# EAGLE design spi_neopixel_rev2 (EAGLE 8.5.0)
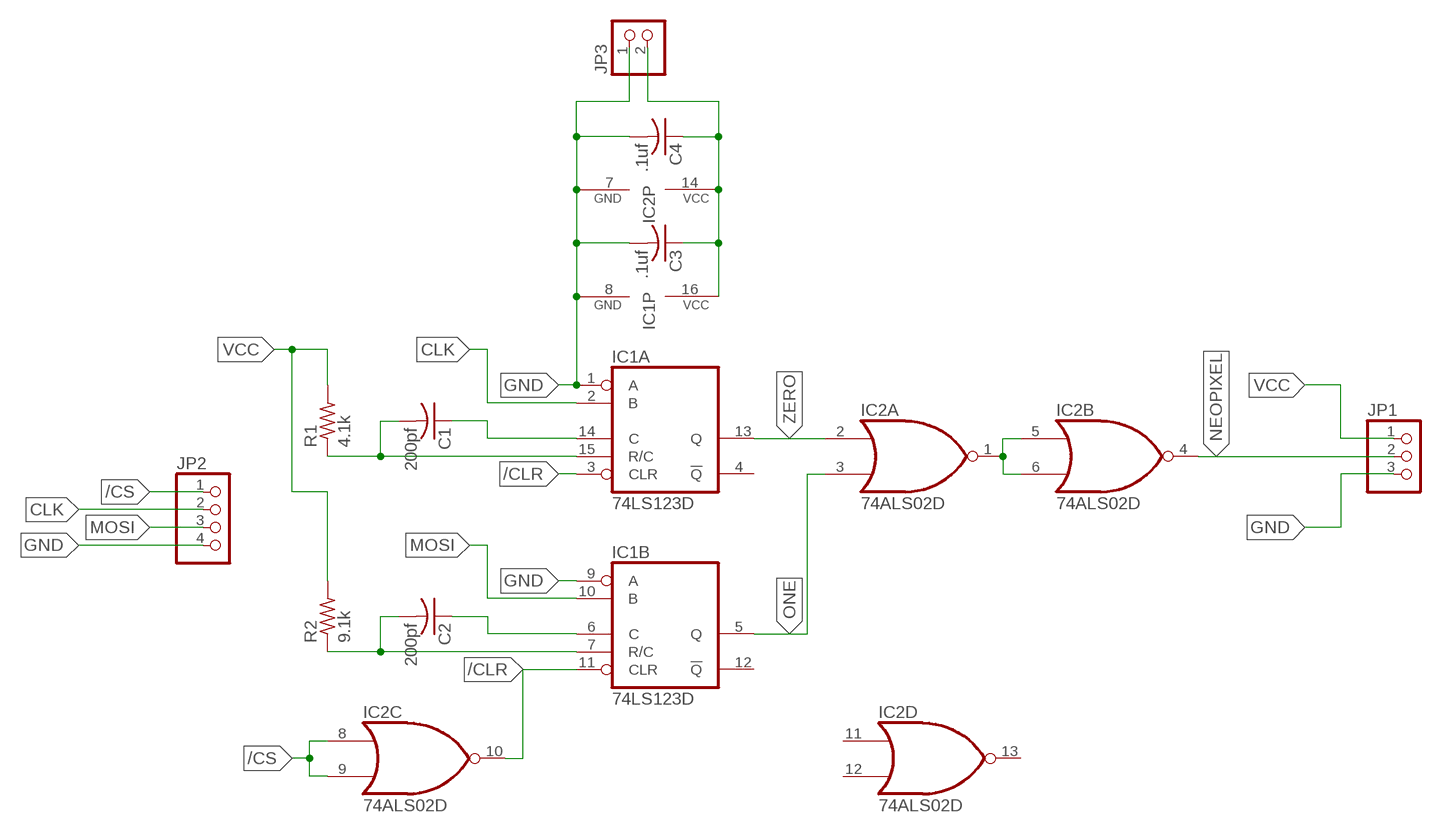
[diagram p0: schematic, sheet 1]

## Parts
C1  200pf  C-USC0805  [C0805]
C2  200pf  C-USC0805  [C0805]
C3  .1uf  C-USC0805  [C0805]
C4  .1uf  C-USC0805  [C0805]
IC1  74LS123D  [SO16]
IC2  74ALS02D  [SO14]
JP1  PINHD-1X3  [1X03]
JP2  PINHD-1X4  [1X04]
JP3  PINHD-1X2  [1X02]
R1  4.1k  R-US_M0805  [M0805]
R2  9.1k  R-US_M0805  [M0805]

## Nets
/CLR: IC1.3(A:CLR) IC1.11(B:CLR) IC2.10(C:O)
/CS: IC2.8(C:I0) IC2.9(C:I1) JP2.1
CLK: IC1.2(A:B) JP2.2
GND: C3.2 C4.2 IC1.1(A:A) IC1.8(P:GND) IC1.9(B:A) IC2.7(P:GND) JP1.3 JP2.4 JP3.1
MOSI: IC1.10(B:B) JP2.3
N$1: IC2.1(A:O) IC2.5(B:I0) IC2.6(B:I1)
N$3: C1.2 IC1.15(A:R/C) R1.1
N$4: C2.2 IC1.7(B:R/C) R2.1
N$5: C1.1 IC1.14(A:C)
N$6: C2.1 IC1.6(B:C)
NEOPIXEL: IC2.4(B:O) JP1.2
ONE: IC1.5(B:Q) IC2.3(A:I1)
VCC: C3.1 C4.1 IC1.16(P:VCC) IC2.14(P:VCC) JP1.1 JP3.2 R1.2 R2.2
ZERO: IC1.13(A:Q) IC2.2(A:I0)
Unconnected: IC1.4(A:!Q) IC1.12(B:!Q) IC2.11(D:I0) IC2.12(D:I1) IC2.13(D:O)

## Library data of the parts
C1-C4 = rcl:C-US: CAPACITOR, American symbol; SPICEPREFIX: C
IC1 = 74xx-us:74*123: Retriggerable monostable MULTIVIBRATOR
IC2 = 74xx-us:74*02: Quad 2-input NOR gate
JP1 = pinhead:PINHD-1X3: PIN HEADER
JP2 = pinhead:PINHD-1X4: PIN HEADER
JP3 = pinhead:PINHD-1X2: PIN HEADER
R1 R2 = rcl:R-US_: RESISTOR, American symbol; SPICEPREFIX: R

## Board
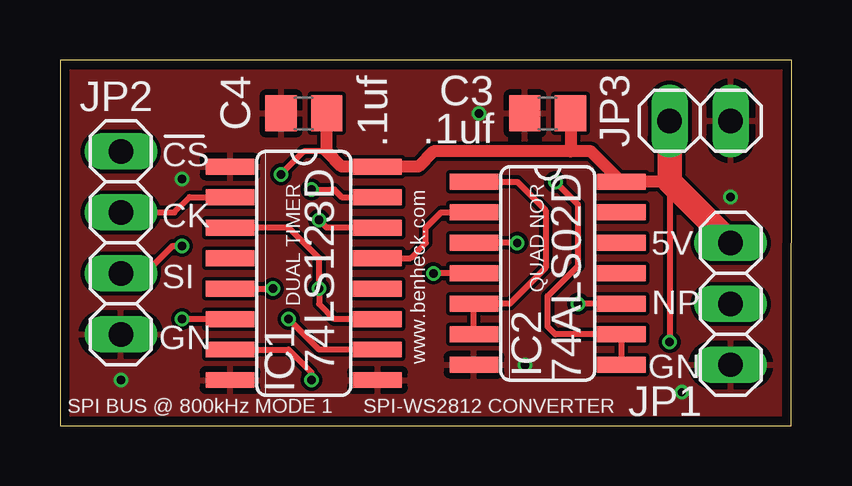
[diagram p1: board, top side]
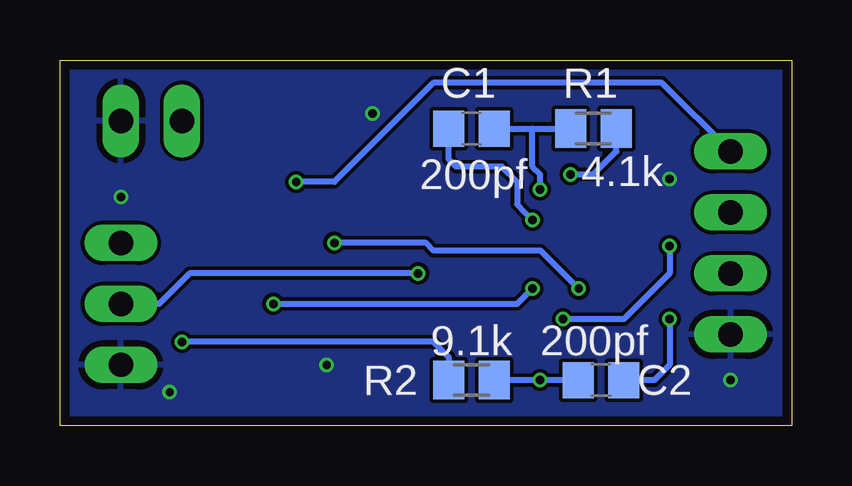
[diagram p2: board, bottom side, seen from below]

Size 30.48 x 15.24 mm. Coordinates in mm from the lower left corner, seen from the top.
Outline: 0,0 30.46,0 30.48,15.24 0,15.24 0,0
Copper layers (1*16): Top 0.035559375mm / dielectric 1.6mm / Bottom 0.035559375mm
Design rules "oshpark-2layer": minimum track width 6mil, minimum drill 10mil, track to track 6mil, track to pad 6mil, pad to pad 6mil, via to via 6mil, smd to smd 6mil, copper to edge 15mil, drill to drill 6mil, minimum pad ring 5mil, minimum via ring 5mil, stop-mask expansion 2.5mil, vias tented up to drill 0mil, thermal gap 10mil

### Footprints (pad centres in the part's own frame; a part is rotated, then mirrored left to right if it is on the bottom)
C0805 = smd 1.3 x 1.5: 1 -0.95,0; 2 0.95,0
SO16 = smd 0.66 x 2.032: 1 -4.445,-3.073; 2 -3.175,-3.073; 3 -1.905,-3.073; 4 -0.635,-3.073; 5 0.635,-3.073; 6 1.905,-3.073; 7 3.175,-3.073; 8 4.445,-3.073; 9 4.445,3.073; 10 3.175,3.073; 11 1.905,3.073; 12 0.635,3.073; 13 -0.635,3.073; 14 -1.905,3.073; 15 -3.175,3.073; 16 -4.445,3.073
SO14 = smd 0.66 x 2.032: 1 -3.81,-3.073; 2 -2.54,-3.073; 3 -1.27,-3.073; 4 0,-3.073; 5 1.27,-3.073; 6 2.54,-3.073; 7 3.81,-3.073; 8 3.81,3.073; 9 2.54,3.073; 10 1.27,3.073; 11 0,3.073; 12 -1.27,3.073; 13 -2.54,3.073; 14 -3.81,3.073
1X03 = drill 1.016 long: 1 -2.54,0; 2 0,0; 3 2.54,0
1X04 = drill 1.016 long: 1 -3.81,0; 2 -1.27,0; 3 1.27,0; 4 3.81,0
1X02 = drill 1.016 long: 1 -1.27,0; 2 1.27,0
M0805 = smd 1.3 x 1.6: 1 -0.95,0; 2 0.95,0

### Placement (x,y rotation side)
C1  13.34,12.38 0 bottom
C2  7.94,1.91 180 bottom
C3  20.32,13.02 180 top
C4  10.16,13.02 180 top
IC1  10.16,6.35 270 top
IC2  20.32,6.35 270 top
JP1  27.94,5.08 270 top
JP2  2.54,7.62 270 top
JP3  26.67,12.7 180 top
R1  8.26,12.38 0 bottom
R2  13.34,1.91 180 bottom

### Tracks (layer width: path | path; a pad name or v marks a point on that pad's centre or on a via)
/CLR  (via drill 0.35)
  Top 0.254: IC1.11 11.43,4.45 10.79,5.08 v10.79,5.71 10.79,6.99 9.53,8.26 IC1.3 | IC2.10 v21.59,5.08
  Bottom 0.254: v21.59,5.08 11.43,5.08 v10.79,5.71
/CS  (via drill 0.35 pad 0.6)
  Top 0.254: IC2.8 IC2.9 20.64,3.81 20.32,4.13 20.32,5.4 21.59,6.67 21.59,9.21 v20.64,10.16
  Bottom 0.254: JP2.1 5.4,14.29 14.92,14.29 19.05,10.16 v20.64,10.16
CLK
  Top 0.254: JP2.2 4.76,8.89 5.4,9.53 IC1.2
GND  (via drill 0.35 pad 0.6)
  other vias: 19.37,2.54 2.54,1.91 5.08,10.29 17.46,13.02 27.94,9.53 25.91,1.4
  pour Top: -0.95,16.19 31.43,16.19 31.43,-0.95 -0.95,-0.95
  pour Bottom: -1.27,16.83 32.07,16.83 32.07,-1.59 -1.27,-1.59
MOSI  (via drill 0.35, 0.35 pad 0.6)
  Top 0.254: v9.53,4.45 10.79,3.17 IC1.10 | JP2.3 3.56,6.35 4.7,7.49 v5.08,7.49
  Bottom 0.254: v9.53,4.45 6.99,4.45 5.08,6.35 v5.08,7.49
N$1
  Top 0.254: IC2.6 IC2.5 18.73,5.08 20.23,6.58 20.23,8.98 19.05,10.16 IC2.1
N$3  (via drill 0.35 pad 0.6)
  Top 0.254: IC1.15 11.75,9.53 11.43,9.84 v10.48,9.84
  Bottom 0.254: C1.2 10.79,12.38 | 10.79,12.38 R1.1 | 10.79,12.38 10.79,10.79 10.48,10.48 v10.48,9.84
N$4  (via drill 0.35 pad 0.6)
  Top 0.254: IC1.7 9.53,3.17 10.48,2.22 v10.48,1.91
  Bottom 0.254: C2.2 v10.48,1.91 R2.1
N$5  (via drill 0.35 pad 0.6)
  Top 0.254: IC1.14 11.11,8.26 v10.79,8.57
  Bottom 0.254: C1.1 14.29,11.75 14.29,11.11 13.97,10.79 12.06,10.79 11.43,10.16 11.43,9.23 v10.79,8.57
N$6  (via drill 0.35)
  Top 0.254: IC1.6 v5.08,4.45
  Bottom 0.254: v5.08,4.45 5.08,2.54 5.71,1.91 C2.1
NEOPIXEL  (via drill 0.35)
  Top 0.254: IC2.4 v15.56,6.35
  Bottom 0.254: v15.56,6.35 25.08,6.35 26.35,5.08 JP1.2
ONE  (via drill 0.35)
  Top 0.254: IC1.5 v8.87,5.71 8.89,5.71 | v19.05,7.62 IC2.3
  Bottom 0.254: v19.05,7.62 15.24,7.62 14.92,7.3 10.46,7.3 v8.87,5.71
VCC  (via drill 0.35 pad 0.6)
  Top 0.254: 25.4,10.16 v25.4,3.49 | 11.11,11.43 10.16,11.43 v9.21,10.48
  Top 0.508: 21.27,11.43 22.12,11.43 IC2.14 25.4,10.16 | 21.27,11.43 15.56,11.43 14.92,10.79 IC1.16 11.75,10.79 11.11,11.43 C4.1 | C3.1 21.27,11.43
  Top 1.016: JP1.1 25.4,10.16 JP3.2
  Bottom 0.254: R2.2 14.29,2.85 14.92,3.49 v25.4,3.49 | v9.21,10.48 8.26,10.48 7.3,11.43 R1.2
ZERO
  Top 0.254: IC1.13 14.61,6.99 15.24,7.62 15.24,8.26 15.88,8.89 IC2.2

### Text on the board
tPlace: CS | CK | 5V | SI | NP | GN | GN
tNames: DUAL TIMER | www.benheck.com | QUAD NOR | SPI BUS @ 800kHz MODE 1 | SPI-WS2812 CONVERTER
Document: 5V | GND